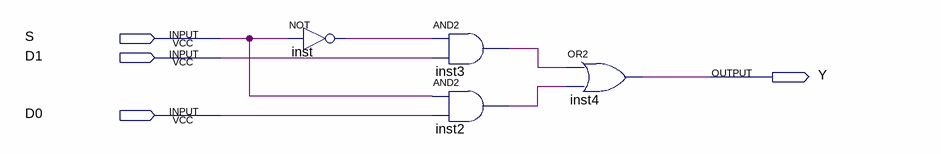
[diagram p0: schematic sheet]
// Quartus schematic MUX21-1BIT.bdf as structural Verilog: 4 symbols, 4 pins
module \MUX21-1BIT  (
  input  S,
  input  D1,
  input  D0,
  output Y
);

  wire inst2_out, inst3_out, inst_out;

  not inst (inst_out, S);
  and inst3 (inst3_out, inst_out, D1);
  and inst2 (inst2_out, S, D0);
  or inst4 (Y, inst3_out, inst2_out);
endmodule
